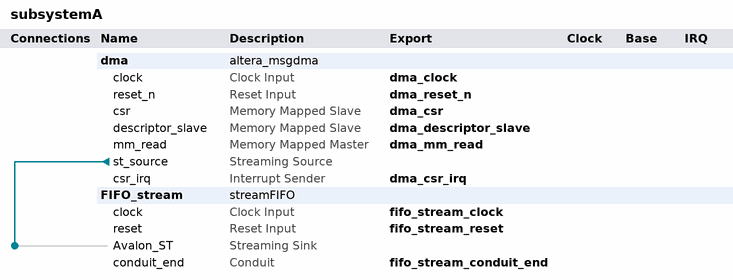
[diagram p0: system contents]
# Platform Designer (Qsys) system subsystemA, Stratix IV EP4SGX230KF40C2
# Parameters at their usual value, and those the tool derives, are not listed.
package require -exact qsys 18.1
create_system subsystemA
set_project_property DEVICE_FAMILY {Stratix IV}
set_project_property DEVICE EP4SGX230KF40C2

add_instance dma altera_msgdma 18.1
set_instance_parameter_value dma BURST_ENABLE 1
set_instance_parameter_value dma DATA_FIFO_DEPTH 2048
set_instance_parameter_value dma DATA_WIDTH 256
set_instance_parameter_value dma DESCRIPTOR_FIFO_DEPTH 512
set_instance_parameter_value dma ENHANCED_FEATURES 0
set_instance_parameter_value dma ERROR_ENABLE 0
set_instance_parameter_value dma MAX_BURST_COUNT 4
set_instance_parameter_value dma MAX_BYTE 16384
set_instance_parameter_value dma MODE 1
set_instance_parameter_value dma PACKET_ENABLE 0
set_instance_parameter_value dma TRANSFER_TYPE {Full Word Accesses Only}

add_instance FIFO_stream streamFIFO 1.6

# connections
add_connection dma.st_source FIFO_stream.Avalon_ST avalon_streaming

# exported interfaces
add_interface dma_clock clock sink
set_interface_property dma_clock EXPORT_OF dma.clock
add_interface dma_csr avalon slave
set_interface_property dma_csr EXPORT_OF dma.csr
add_interface dma_csr_irq interrupt sender
set_interface_property dma_csr_irq EXPORT_OF dma.csr_irq
add_interface dma_descriptor_slave avalon slave
set_interface_property dma_descriptor_slave EXPORT_OF dma.descriptor_slave
add_interface dma_mm_read avalon master
set_interface_property dma_mm_read EXPORT_OF dma.mm_read
add_interface dma_reset_n reset sink
set_interface_property dma_reset_n EXPORT_OF dma.reset_n
add_interface fifo_stream_clock clock sink
set_interface_property fifo_stream_clock EXPORT_OF FIFO_stream.clock
add_interface fifo_stream_conduit_end conduit end
set_interface_property fifo_stream_conduit_end EXPORT_OF FIFO_stream.conduit_end
add_interface fifo_stream_reset reset sink
set_interface_property fifo_stream_reset EXPORT_OF FIFO_stream.reset

set_interconnect_requirement {$system} qsys_mm.clockCrossingAdapter HANDSHAKE
set_interconnect_requirement {$system} qsys_mm.enableEccProtection FALSE
set_interconnect_requirement {$system} qsys_mm.insertDefaultSlave FALSE
set_interconnect_requirement {$system} qsys_mm.maxAdditionalLatency 1

save_system subsystemA.qsys
